# EAGLE schematic lul (EAGLE 8.2.2)
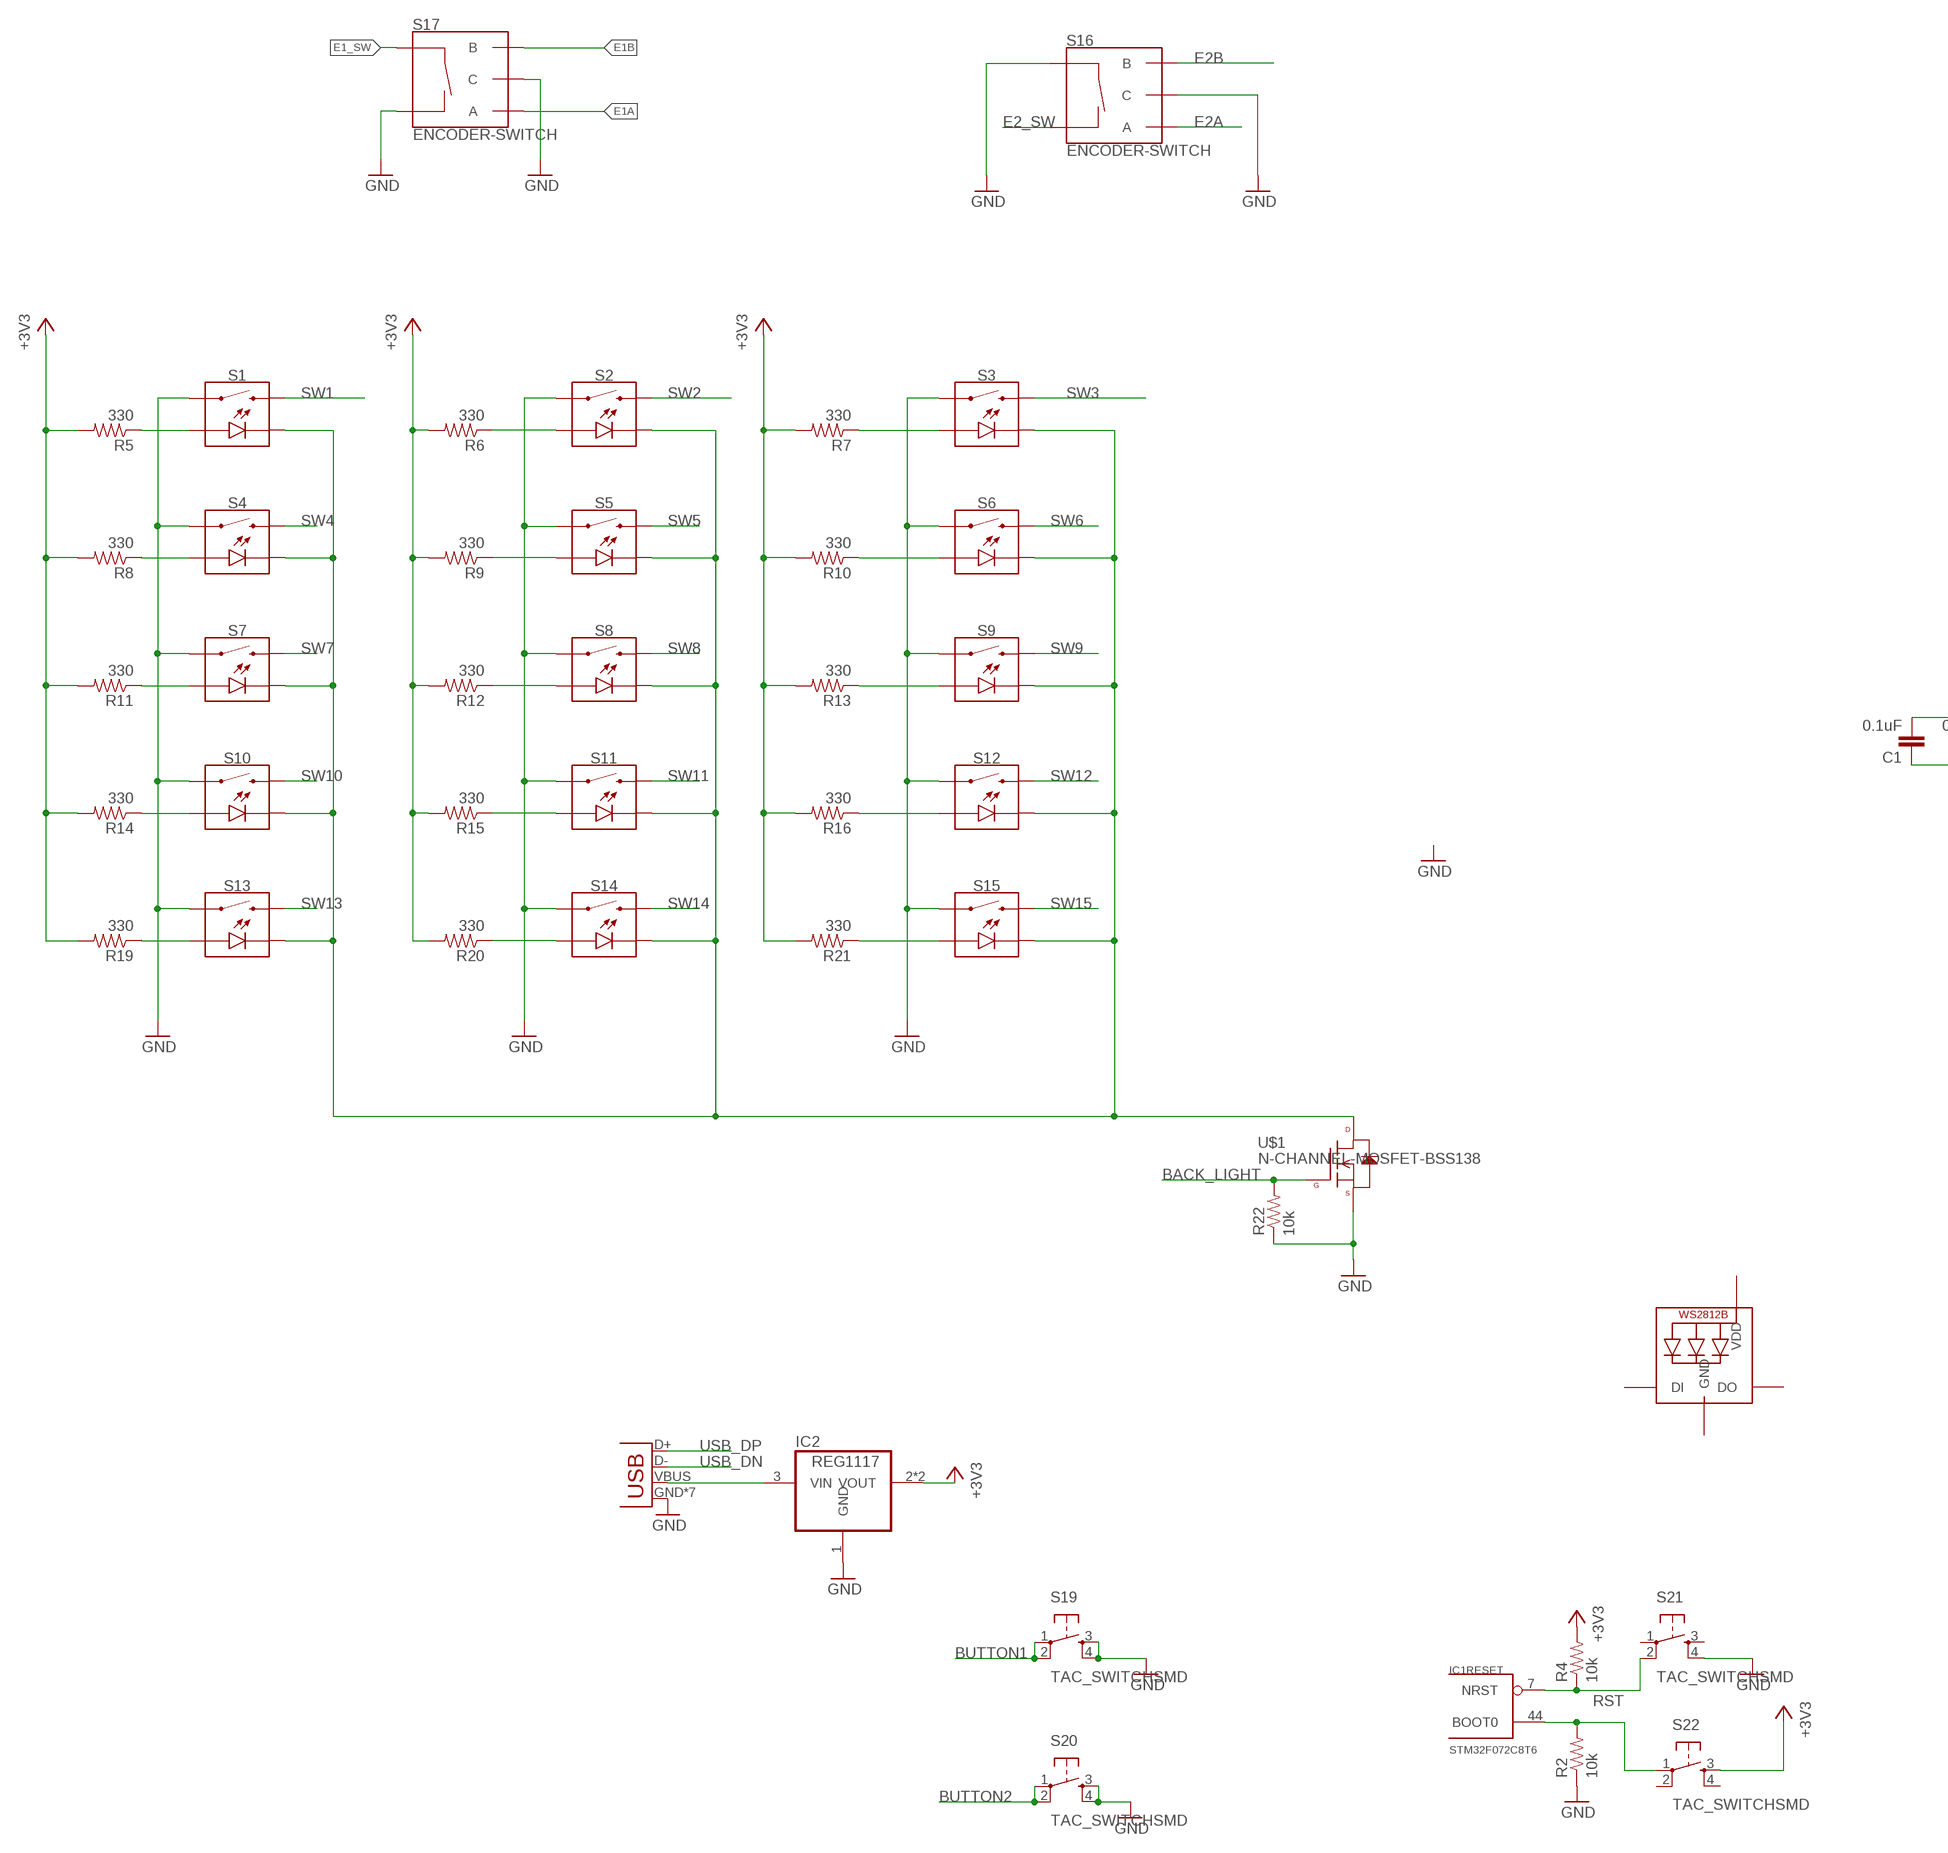
[diagram p0: schematic, sheet 1, part 1 of 2]
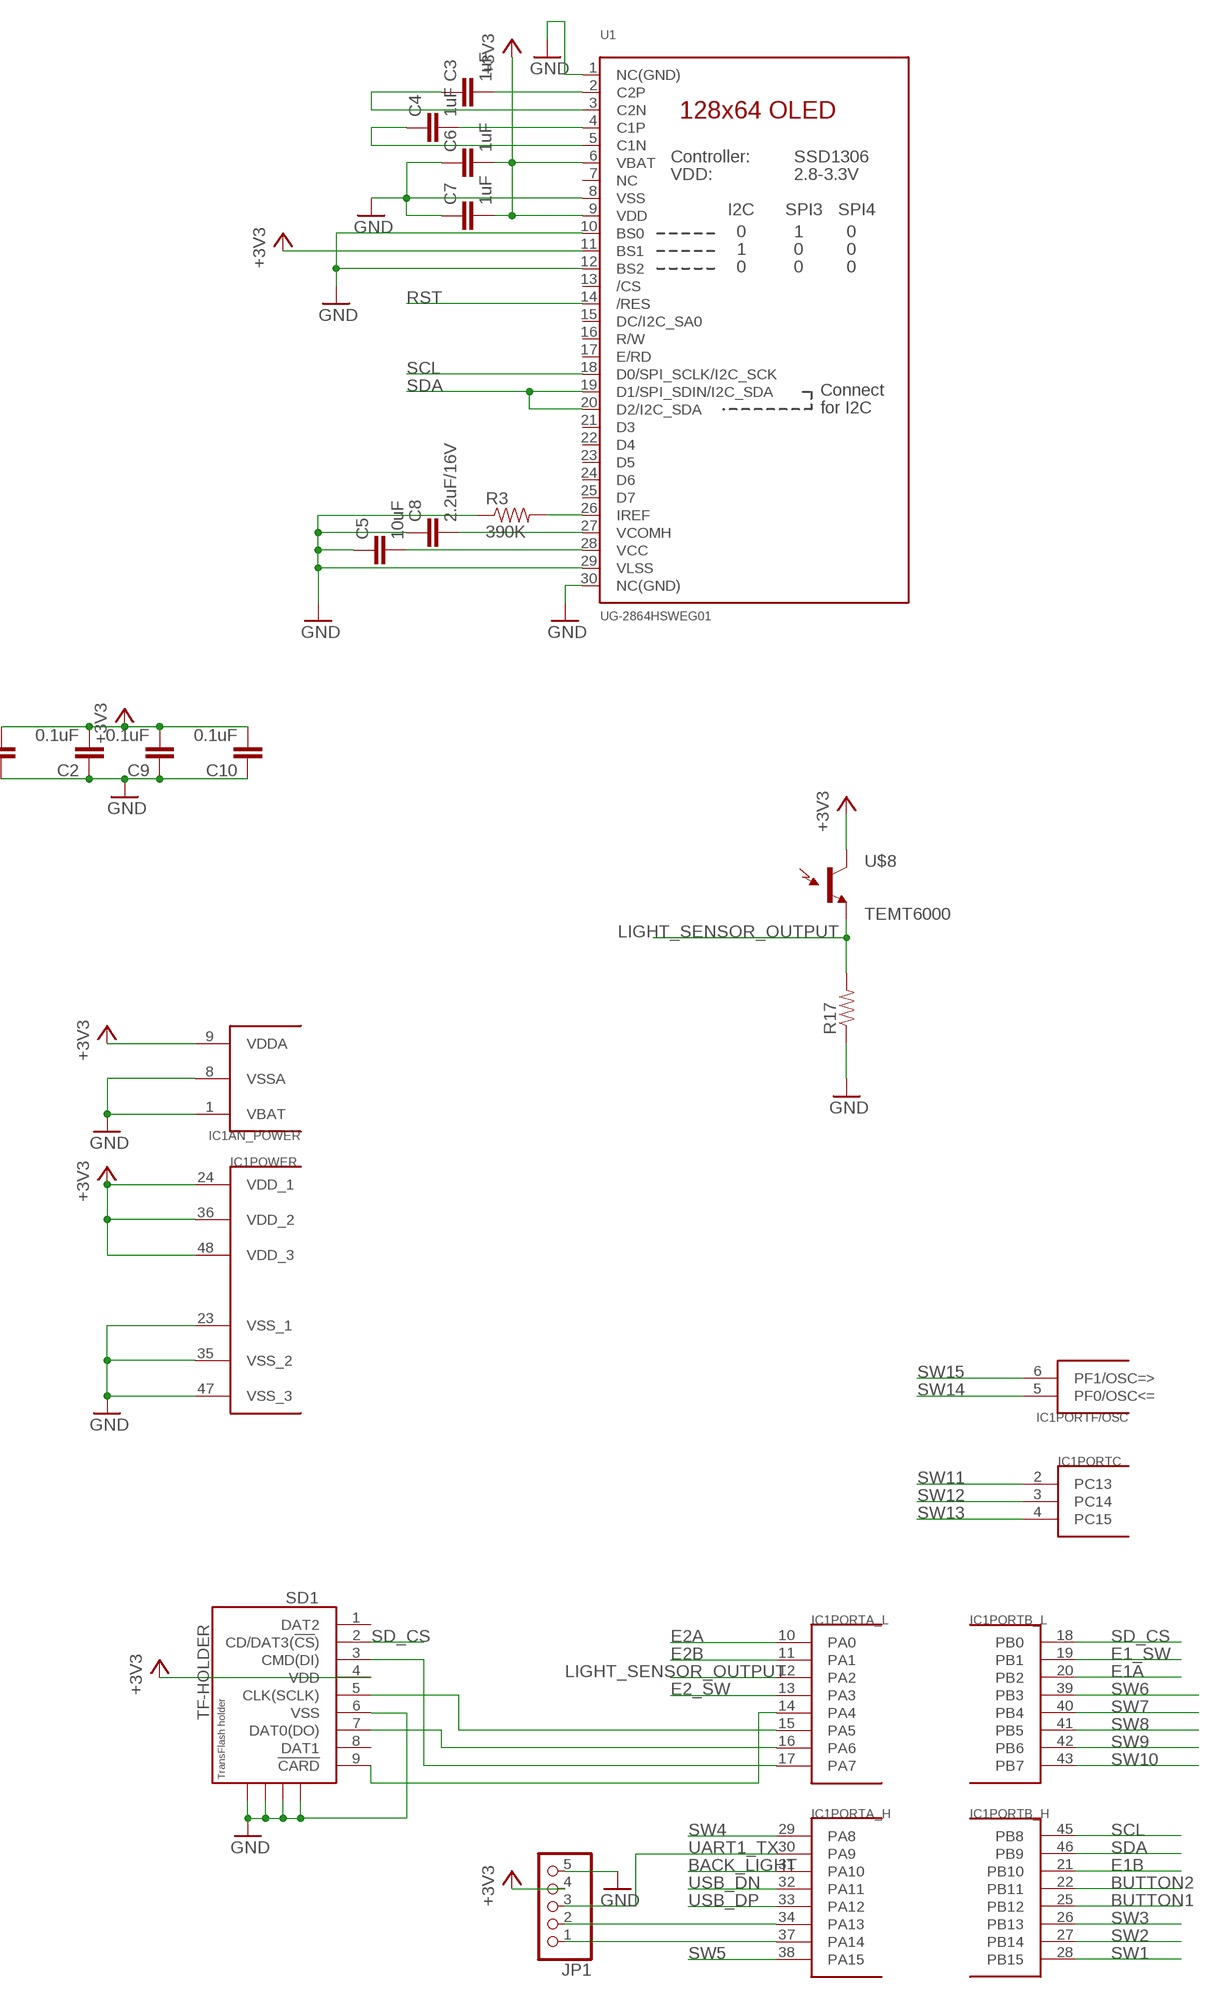
[diagram p1: schematic, sheet 1, part 2 of 2]

## Parts
C1  0.1uF  CAP0805  [0805@1]
C2  0.1uF  CAP0805  [0805@1]
C3  1uF  CAP0805  [0805@1]
C4  1uF  CAP0805  [0805@1]
C5  10uF  CAP0805  [0805@1]
C6  1uF  CAP0805  [0805@1]
C7  1uF  CAP0805  [0805@1]
C8  2.2uF/16V  CAP0805  [0805@1]
C9  0.1uF  CAP0805  [0805@1]
C10  0.1uF  CAP0805  [0805@1]
IC1  STM32F072C8T6  [TQFP48]
IC2  REG1117  [SOT223]
JP1  PINHD-1X5  [1X05]
LED1  WS2812B3535  [LED3535]
R2  10k  RESISTOR0805-RES  [0805]
R3  390K  RESISTOR0805-RES  [0805]
R4  10k  RESISTOR0805-RES  [0805]
R5  330  RESISTOR0805-RES  [0805]
R6  330  RESISTOR0805-RES  [0805]
R7  330  RESISTOR0805-RES  [0805]
R8  330  RESISTOR0805-RES  [0805]
R9  330  RESISTOR0805-RES  [0805]
R10  330  RESISTOR0805-RES  [0805]
R11  330  RESISTOR0805-RES  [0805]
R12  330  RESISTOR0805-RES  [0805]
R13  330  RESISTOR0805-RES  [0805]
R14  330  RESISTOR0805-RES  [0805]
R15  330  RESISTOR0805-RES  [0805]
R16  330  RESISTOR0805-RES  [0805]
R17  RESISTOR0805-RES  [0805]
R19  330  RESISTOR0805-RES  [0805]
R20  330  RESISTOR0805-RES  [0805]
R21  330  RESISTOR0805-RES  [0805]
R22  10k  RESISTOR0805-RES  [0805]
S1  MOMENTARY-SWITCH-SPST-LED-PTH-CHERRY  [CHERRY-MX-LED]
S2  MOMENTARY-SWITCH-SPST-LED-PTH-CHERRY  [CHERRY-MX-LED]
S3  MOMENTARY-SWITCH-SPST-LED-PTH-CHERRY  [CHERRY-MX-LED]
S4  MOMENTARY-SWITCH-SPST-LED-PTH-CHERRY  [CHERRY-MX-LED]
S5  MOMENTARY-SWITCH-SPST-LED-PTH-CHERRY  [CHERRY-MX-LED]
S6  MOMENTARY-SWITCH-SPST-LED-PTH-CHERRY  [CHERRY-MX-LED]
S7  MOMENTARY-SWITCH-SPST-LED-PTH-CHERRY  [CHERRY-MX-LED]
S8  MOMENTARY-SWITCH-SPST-LED-PTH-CHERRY  [CHERRY-MX-LED]
S9  MOMENTARY-SWITCH-SPST-LED-PTH-CHERRY  [CHERRY-MX-LED]
S10  MOMENTARY-SWITCH-SPST-LED-PTH-CHERRY  [CHERRY-MX-LED]
S11  MOMENTARY-SWITCH-SPST-LED-PTH-CHERRY  [CHERRY-MX-LED]
S12  MOMENTARY-SWITCH-SPST-LED-PTH-CHERRY  [CHERRY-MX-LED]
S13  MOMENTARY-SWITCH-SPST-LED-PTH-CHERRY  [CHERRY-MX-LED]
S14  MOMENTARY-SWITCH-SPST-LED-PTH-CHERRY  [CHERRY-MX-LED]
S15  MOMENTARY-SWITCH-SPST-LED-PTH-CHERRY  [CHERRY-MX-LED]
S16  ENCODER-SWITCH  [ROTARY_ENC_PLAIN]
S17  ENCODER-SWITCH  [ROTARY_ENC_PLAIN]
S19  TAC_SWITCHSMD  [TACTILE-SWITCH-SMD]
S20  TAC_SWITCHSMD  [TACTILE-SWITCH-SMD]
S21  TAC_SWITCHSMD  [TACTILE-SWITCH-SMD]
S22  TAC_SWITCHSMD  [TACTILE-SWITCH-SMD]
SD1  TF-HOLDER  [TF-PULL]
U1  UG-2864HSWEG01  DISP_OLED_UG-2864HSWEG010.96"  [UG-2864HSWEG01_0.96IN_WRAPAROUND]
U$1  N-CHANNEL-MOSFET-BSS138  [SOT23-3]
U$8  TEMT6000  [TEMT6000-SEN]
X1  USB-MICROB  [USB-MICROB]

## Nets
+3V3: C1.2 C2.2 C6.2 C7.2 C9.2 C10.2 IC1.9(AN_POWER:VDDA) IC1.24(POWER:VDD_1) IC1.36(POWER:VDD_2) IC1.48(POWER:VDD_3) IC2.2(VOUT) IC2.4(VOUT) JP1.4 R4.2 R5.2 R6.2 R7.2 R8.2 R9.2 R10.2 R11.2 R12.2 R13.2 R14.2 R15.2 R16.2 R19.2 R20.2 R21.2 S22.3 SD1.4(VDD) U1.6(VBAT) U1.9(VDD) U1.11(BS1) U$8.COLLECTOR(C1)
BACK_LIGHT: IC1.31(PORTA_H:PA10) R22.2 U$1.1(G)
BUTTON1: IC1.25(PORTB_H:PB12) S19.1 S19.2
BUTTON2: IC1.22(PORTB_H:PB11) S20.1 S20.2
E1_SW: IC1.19(PORTB_L:PB1) S17.SW+
E1A: IC1.20(PORTB_L:PB2) S17.A
E1B: IC1.21(PORTB_H:PB10) S17.B
E2_SW: IC1.13(PORTA_L:PA3) S16.SW-
E2A: IC1.10(PORTA_L:PA0) S16.A
E2B: IC1.11(PORTA_L:PA1) S16.B
GND: C1.1 C2.1 C5.1 C6.1 C7.1 C8.1 C9.1 C10.1 IC1.1(AN_POWER:VBAT) IC1.8(AN_POWER:VSSA) IC1.23(POWER:VSS_1) IC1.35(POWER:VSS_2) IC1.47(POWER:VSS_3) IC2.1(GND) JP1.5 R2.1 R3.1 R17.1 R22.1 S1.S1 S2.S1 S3.S1 S4.S1 S5.S1 S6.S1 S7.S1 S8.S1 S9.S1 S10.S1 S11.S1 S12.S1 S13.S1 S14.S1 S15.S1 S16.C S16.SW+ S17.C S17.SW- S19.3 S19.4 S20.3 S20.4 S21.4 SD1.6(VSS) SD1.S1 SD1.S2 SD1.S3 SD1.S4 U1.1(NC(GND)) U1.8(VSS) U1.10(BS0) U1.12(BS2) U1.29(VLSS) U1.30(NC(GND)) U$1.2(S) X1.GND X1.P1(GND) X1.P2(GND) X1.P3(GND) X1.P4(GND) X1.P5(GND) X1.P6(GND)
LIGHT_SENSOR_OUTPUT: IC1.12(PORTA_L:PA2) R17.2 U$8.EMITTER(E1)
N$1: IC2.3(VIN) X1.VBUS
N$2: IC1.44(RESET:BOOT0) R2.2 S22.1
N$3: R3.2 U1.26(IREF)
N$4: C3.2 U1.2(C2P)
N$5: C3.1 U1.3(C2N)
N$6: C4.2 U1.4(C1P)
N$7: C4.1 U1.5(C1N)
N$8: IC1.15(PORTA_L:PA5) SD1.5(CLK(SCLK))
N$10: IC1.16(PORTA_L:PA6) SD1.7(DAT0(DO))
N$11: C5.2 U1.28(VCC)
N$12: C8.2 U1.27(VCOMH)
N$13: IC1.17(PORTA_L:PA7) SD1.3(CMD(DI))
N$14: IC1.14(PORTA_L:PA4) SD1.9(!CARD)
N$15: R5.1 S1.A
N$16: R8.1 S4.A
N$17: R11.1 S7.A
N$18: R14.1 S10.A
N$19: R19.1 S13.A
N$20: R6.1 S2.A
N$21: R9.1 S5.A
N$22: R12.1 S8.A
N$23: R15.1 S11.A
N$24: R20.1 S14.A
N$25: R7.1 S3.A
N$26: R10.1 S6.A
N$27: R13.1 S9.A
N$28: R16.1 S12.A
N$29: R21.1 S15.A
N$30: S1.K(C) S2.K(C) S3.K(C) S4.K(C) S5.K(C) S6.K(C) S7.K(C) S8.K(C) S9.K(C) S10.K(C) S11.K(C) S12.K(C) S13.K(C) S14.K(C) S15.K(C) U$1.3(D)
N$32: IC1.37(PORTA_H:PA14) JP1.1
N$34: IC1.34(PORTA_H:PA13) JP1.2
RST: IC1.7(RESET:NRST) R4.1 S21.2 U1.14(/RES)
SCL: IC1.45(PORTB_H:PB8) U1.18(D0/SPI_SCLK/I2C_SCK)
SD_CS: IC1.18(PORTB_L:PB0) SD1.2(CD/DAT3(!CS!))
SDA: IC1.46(PORTB_H:PB9) U1.19(D1/SPI_SDIN/I2C_SDA) U1.20(D2/I2C_SDA)
SW1: IC1.28(PORTB_H:PB15) S1.S2
SW2: IC1.27(PORTB_H:PB14) S2.S2
SW3: IC1.26(PORTB_H:PB13) S3.S2
SW4: IC1.29(PORTA_H:PA8) S4.S2
SW5: IC1.38(PORTA_H:PA15) S5.S2
SW6: IC1.39(PORTB_L:PB3) S6.S2
SW7: IC1.40(PORTB_L:PB4) S7.S2
SW8: IC1.41(PORTB_L:PB5) S8.S2
SW9: IC1.42(PORTB_L:PB6) S9.S2
SW10: IC1.43(PORTB_L:PB7) S10.S2
SW11: IC1.2(PORTC:PC13) S11.S2
SW12: IC1.3(PORTC:PC14) S12.S2
SW13: IC1.4(PORTC:PC15) S13.S2
SW14: IC1.5(PORTF/OSC:PF0/OSC<=) S14.S2
SW15: IC1.6(PORTF/OSC:PF1/OSC=>) S15.S2
UART1_TX: IC1.30(PORTA_H:PA9) JP1.3
USB_DN: IC1.32(PORTA_H:PA11) X1.D-
USB_DP: IC1.33(PORTA_H:PA12) X1.D+
Unconnected: LED1.1(DI) LED1.3(DO) S21.1 S21.3 S22.2 S22.4 SD1.1(DAT2) SD1.8(DAT1) U1.7(NC) U1.13(/CS) U1.15(DC/I2C_SA0) U1.16(R/W) U1.17(E/RD) U1.21(D3) U1.22(D4) U1.23(D5) U1.24(D6) U1.25(D7)

## Power pins joined to a net without a drawn wire
GND: LED1.4(GND)
VDD: LED1.2(VDD)

## Library data of the parts
C1-C10 = clock:CAP: Capacitor Standard 0603 ceramic capacitor, and 0.1" leaded capacitor.
IC1 = clock:STM32F072C8T6: ST STM32F072 48pin LQFP
IC2 = clock:REG1117: 800mA and 1A Low Dropout (LDO) Positive Regulator 1.8V, 2.5V, 2.85V, 3.3V, 5V, and Adj; MPN: REG1117; OC_FARNELL: 1097566; OC_NEWARK: 14P6981
JP1 = pinhead:PINHD-1X5: PIN HEADER
LED1 = adafruit:WS2812B
R2-R17 R19-R22 = clock:RESISTOR: Resistor Basic schematic elements and footprints for 0603, 1206, and PTH resistors.
S1-S15 = SparkFun-Switches:MOMENTARY-SWITCH-SPST-LED: Momentary Switch (Pushbutton) - SPST - w/ LED Normally-open (NO) SPST momentary switches (buttons, pushbuttons), with a built-in LED. Variants PTH-CHERRY - Cherry MX Switch Cherry MX Keyswitches are top-of-the-line mechanical keyboard switches. They’re satisfyingly “clicky”, reliable up to tens-of-millions of key presses, and a standard in gaming and programming keyboards across the globe. This ‘blue’ version Cherry MX Switch is favored by most due to its secondary internal actuator making it less likely to “double-tap.” If you are looking for a noticeably audible and high-quality key switch, this is the perfect option for you! Cherry MX Switch <https://www.sparkfun.com/products/13834> (COM-13834) Cherry MX Switch Breakout <https://www.sparkfun.com/products/13773> (BOB-13773) PTH-12MM and PTH-12MM-KIT - 12mm Illuminated LED KIT variant is for soldering kits. There is no tStop (covering up the top side of the pads with mask). This helps the beginner see which side they should be soldering too. LED Tactile Button Breakout <https://www.sparkfun.com/products/10467> (BOB-10467) LED Tactile Button - Red <https://www.sparkfun.com/products/10442> (COM-10442) LED Tactile Button - Blue <https://www.sparkfun.com/products/10443> (COM-10443) LED Tactile Button - Green <https://www.sparkfun.com/products/10440> (COM-10440) LED Tactile Button - Orange <https://www.sparkfun.com/products/10441> (COM-10441) LED Tactile Button - White <https://www.sparkfun.com/products/10439> (COM-10439); SF_ID: COM-13834
S16 S17 = SparkFun-Switches:ENCODER-SWITCH: Rotary Encoder w/ Select Switch Encoders rotate similarly to potentiometers, but they’re different from potentiometers in that an encoder has full rotation without limits. They output gray code so that you can tell how much and in which direction the encoder has been turned. This encoder includes a push-down select switch built into the shaft. SparkFun Products Rotary Encoder <https://www.sparkfun.com/products/9117> (COM-09117); SF_SKU: COM-09117
S19-S22 = clock:TAC_SWITCH: Momentary Switch Button commonly used for reset or general input. Spark Fun Electronics SKU : COM-00097 SMT- SWCH-08247; PROD_ID: SWCH-08247
SD1 = clock:TF-HOLDER: TF / Micro SD socket is PUSH-PUSH type, the card can be pushed into and auto locked and pushed out by simply press the card. Surface Mounting type.
U1 = microbuilder:DISP_OLED_UG-2864HSWEG01: UG-2864HSWEG01 OLED display Both 1.3" and 0.96" models share the same FPC tab footprint, only the screen dimensions vary.
U$1 = basicBoard:N-CHANNEL-MOSFET: N-Channel MOSFET Mode Field Effect Transistor; DATASHEET: http://www.fairchildsemi.com/ds/BS/BSS138.pdf; DIGIKEY: BSS138TR-ND; ELEMENT14: 2323154; URL: http://au.element14.com/fairchild-semiconductor/bss138/mosfet-n-ch-50v-220ma-sot-23/dp/2323154
U$8 = ProtoSnap-v14a:TEMT6000: Ambient Light Sensor Simple light detection sensor. Output varies with light intensity input. Spark Fun Electronics SKU : COM-08348
X1 = clock:USB: USB Connectors USB-B-PTH is fully proven SKU : PRT-00139/CONN-08278 USB-miniB is fully proven SKU : PRT-00587 USB-A-PCB is untested. USB-A-H is throughly reviewed, but untested. Spark Fun Electronics SKU : PRT-00437 USB-B-SMT is throughly reviewed, but untested. Needs silkscreen touching up. USB-A-S has not been used/tested USB-MB-H has not been used/tested USB-MICROB has been used. CONN-09505; PROD_ID: CONN-09505